# EAGLE design 05_08 (EAGLE 9.6.2)
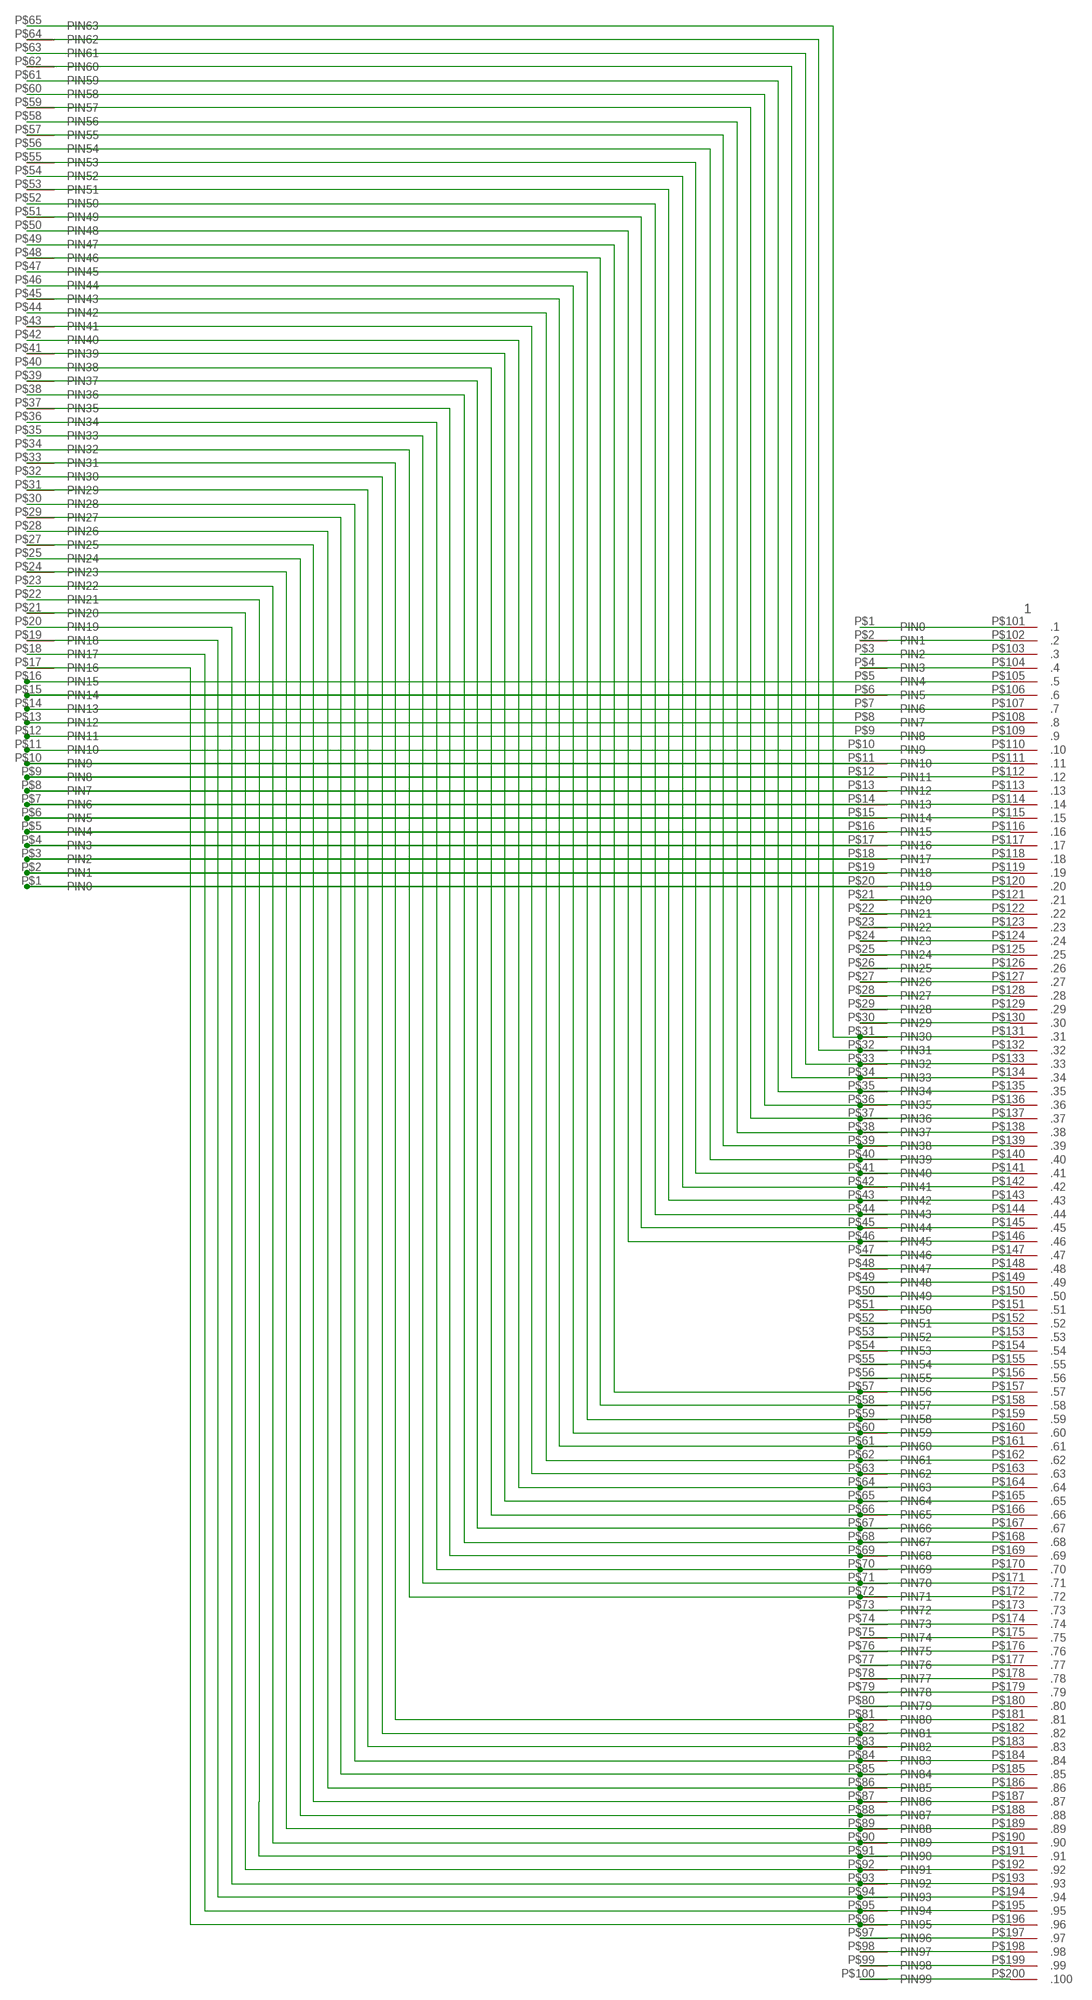
[diagram p0: schematic, sheet 1]

## Parts
U$1  TQFP_100_PIN_1  [TQFP_100PIN_PCB_1]
U$2  TQFP_100_PIN_2  [TQFP_100PIN_PCB_2]
U$3  TQFP_64_PIN  [TQFP_100PIN_PCB_08]

## Nets
1: U$1.P$1(PIN0) U$2.P$101(.1)
N$2: U$1.P$2(PIN1) U$2.P$102(.2)
N$3: U$1.P$3(PIN2) U$2.P$103(.3)
N$4: U$1.P$4(PIN3) U$2.P$104(.4)
N$5: U$1.P$7(PIN6) U$2.P$107(.7) U$3.P$14(PIN13)
N$6: U$1.P$6(PIN5) U$2.P$106(.6) U$3.P$15(PIN14)
N$7: U$1.P$8(PIN7) U$2.P$108(.8) U$3.P$13(PIN12)
N$8: U$1.P$9(PIN8) U$2.P$109(.9) U$3.P$12(PIN11)
N$9: U$1.P$10(PIN9) U$2.P$110(.10) U$3.P$11(PIN10)
N$10: U$1.P$30(PIN29) U$2.P$130(.30)
N$11: U$1.P$11(PIN10) U$2.P$111(.11) U$3.P$10(PIN9)
N$12: U$1.P$12(PIN11) U$2.P$112(.12) U$3.P$9(PIN8)
N$13: U$1.P$13(PIN12) U$2.P$113(.13) U$3.P$8(PIN7)
N$14: U$1.P$14(PIN13) U$2.P$114(.14) U$3.P$7(PIN6)
N$15: U$1.P$15(PIN14) U$2.P$115(.15) U$3.P$6(PIN5)
N$16: U$1.P$16(PIN15) U$2.P$116(.16) U$3.P$5(PIN4)
N$17: U$1.P$17(PIN16) U$2.P$117(.17) U$3.P$4(PIN3)
N$18: U$1.P$18(PIN17) U$2.P$118(.18) U$3.P$3(PIN2)
N$19: U$1.P$19(PIN18) U$2.P$119(.19) U$3.P$2(PIN1)
N$20: U$1.P$20(PIN19) U$2.P$120(.20) U$3.P$1(PIN0)
N$21: U$1.P$21(PIN20) U$2.P$121(.21)
N$22: U$1.P$22(PIN21) U$2.P$122(.22)
N$23: U$1.P$23(PIN22) U$2.P$123(.23)
N$24: U$1.P$24(PIN23) U$2.P$124(.24)
N$25: U$1.P$25(PIN24) U$2.P$125(.25)
N$26: U$1.P$26(PIN25) U$2.P$126(.26)
N$27: U$1.P$27(PIN26) U$2.P$127(.27)
N$28: U$1.P$28(PIN27) U$2.P$128(.28)
N$29: U$1.P$29(PIN28) U$2.P$129(.29)
N$32: U$1.P$32(PIN31) U$2.P$132(.32) U$3.P$64(PIN62)
N$33: U$1.P$33(PIN32) U$2.P$133(.33) U$3.P$63(PIN61)
N$34: U$1.P$34(PIN33) U$2.P$134(.34) U$3.P$62(PIN60)
N$35: U$1.P$35(PIN34) U$2.P$135(.35) U$3.P$61(PIN59)
N$36: U$1.P$36(PIN35) U$2.P$136(.36) U$3.P$60(PIN58)
N$37: U$1.P$37(PIN36) U$2.P$137(.37) U$3.P$59(PIN57)
N$38: U$1.P$38(PIN37) U$2.P$138(.38) U$3.P$58(PIN56)
N$39: U$1.P$39(PIN38) U$2.P$139(.39) U$3.P$57(PIN55)
N$40: U$1.P$40(PIN39) U$2.P$140(.40) U$3.P$56(PIN54)
N$41: U$1.P$41(PIN40) U$2.P$141(.41) U$3.P$55(PIN53)
N$42: U$1.P$42(PIN41) U$2.P$142(.42) U$3.P$54(PIN52)
N$43: U$1.P$43(PIN42) U$2.P$143(.43) U$3.P$53(PIN51)
N$44: U$1.P$44(PIN43) U$2.P$144(.44) U$3.P$52(PIN50)
N$45: U$1.P$45(PIN44) U$2.P$145(.45) U$3.P$51(PIN49)
N$46: U$1.P$46(PIN45) U$2.P$146(.46) U$3.P$50(PIN48)
N$47: U$1.P$47(PIN46) U$2.P$147(.47)
N$48: U$1.P$48(PIN47) U$2.P$148(.48)
N$49: U$1.P$49(PIN48) U$2.P$149(.49)
N$50: U$1.P$50(PIN49) U$2.P$150(.50)
N$51: U$1.P$51(PIN50) U$2.P$151(.51)
N$52: U$1.P$52(PIN51) U$2.P$152(.52)
N$53: U$1.P$53(PIN52) U$2.P$153(.53)
N$54: U$1.P$54(PIN53) U$2.P$154(.54)
N$55: U$1.P$55(PIN54) U$2.P$155(.55)
N$56: U$1.P$56(PIN55) U$2.P$156(.56)
N$57: U$1.P$57(PIN56) U$2.P$157(.57) U$3.P$49(PIN47)
N$58: U$1.P$58(PIN57) U$2.P$158(.58) U$3.P$48(PIN46)
N$59: U$1.P$59(PIN58) U$2.P$159(.59) U$3.P$47(PIN45)
N$60: U$1.P$60(PIN59) U$2.P$160(.60) U$3.P$46(PIN44)
N$61: U$1.P$61(PIN60) U$2.P$161(.61) U$3.P$45(PIN43)
N$62: U$1.P$62(PIN61) U$2.P$162(.62) U$3.P$44(PIN42)
N$63: U$1.P$63(PIN62) U$2.P$163(.63) U$3.P$43(PIN41)
N$64: U$1.P$64(PIN63) U$2.P$164(.64) U$3.P$42(PIN40)
N$65: U$1.P$65(PIN64) U$2.P$165(.65) U$3.P$41(PIN39)
N$66: U$1.P$66(PIN65) U$2.P$166(.66) U$3.P$40(PIN38)
N$67: U$1.P$67(PIN66) U$2.P$167(.67) U$3.P$39(PIN37)
N$68: U$1.P$68(PIN67) U$2.P$168(.68) U$3.P$38(PIN36)
N$69: U$1.P$69(PIN68) U$2.P$169(.69) U$3.P$37(PIN35)
N$70: U$1.P$70(PIN69) U$2.P$170(.70) U$3.P$36(PIN34)
N$71: U$1.P$71(PIN70) U$2.P$171(.71) U$3.P$35(PIN33)
N$72: U$1.P$72(PIN71) U$2.P$172(.72) U$3.P$34(PIN32)
N$73: U$1.P$73(PIN72) U$2.P$173(.73)
N$74: U$1.P$74(PIN73) U$2.P$174(.74)
N$75: U$1.P$75(PIN74) U$2.P$175(.75)
N$76: U$1.P$76(PIN75) U$2.P$176(.76)
N$77: U$1.P$77(PIN76) U$2.P$177(.77)
N$78: U$1.P$78(PIN77) U$2.P$178(.78)
N$79: U$1.P$79(PIN78) U$2.P$179(.79)
N$80: U$1.P$80(PIN79) U$2.P$180(.80)
N$81: U$1.P$81(PIN80) U$2.P$181(.81) U$3.P$33(PIN31)
N$82: U$1.P$82(PIN81) U$2.P$182(.82) U$3.P$32(PIN30)
N$83: U$1.P$83(PIN82) U$2.P$183(.83) U$3.P$31(PIN29)
N$84: U$1.P$84(PIN83) U$2.P$184(.84) U$3.P$30(PIN28)
N$85: U$1.P$85(PIN84) U$2.P$185(.85) U$3.P$29(PIN27)
N$86: U$1.P$86(PIN85) U$2.P$186(.86) U$3.P$28(PIN26)
N$87: U$1.P$87(PIN86) U$2.P$187(.87) U$3.P$27(PIN25)
N$88: U$1.P$88(PIN87) U$2.P$188(.88) U$3.P$25(PIN24)
N$89: U$1.P$89(PIN88) U$2.P$189(.89) U$3.P$24(PIN23)
N$90: U$1.P$90(PIN89) U$2.P$190(.90) U$3.P$23(PIN22)
N$91: U$1.P$91(PIN90) U$2.P$191(.91) U$3.P$22(PIN21)
N$92: U$1.P$92(PIN91) U$2.P$192(.92) U$3.P$21(PIN20)
N$93: U$1.P$93(PIN92) U$2.P$193(.93) U$3.P$20(PIN19)
N$94: U$1.P$94(PIN93) U$2.P$194(.94) U$3.P$19(PIN18)
N$95: U$1.P$95(PIN94) U$2.P$195(.95) U$3.P$18(PIN17)
N$96: U$1.P$96(PIN95) U$2.P$196(.96) U$3.P$17(PIN16)
N$97: U$1.P$97(PIN96) U$2.P$197(.97)
N$98: U$1.P$98(PIN97) U$2.P$198(.98)
N$99: U$1.P$99(PIN98) U$2.P$199(.99)
N$100: U$1.P$100(PIN99) U$2.P$200(.100)
N$101: U$1.P$31(PIN30) U$2.P$131(.31) U$3.P$65(PIN63)
N$102: U$1.P$5(PIN4) U$2.P$105(.5) U$3.P$16(PIN15)

## Library data of the parts
U$1 = MyUserLib:TQFP_100_PIN_1
U$2 = MyUserLib:TQFP_100_PIN_2
U$3 = MyUserLib:TQFP_64_PIN

## Board
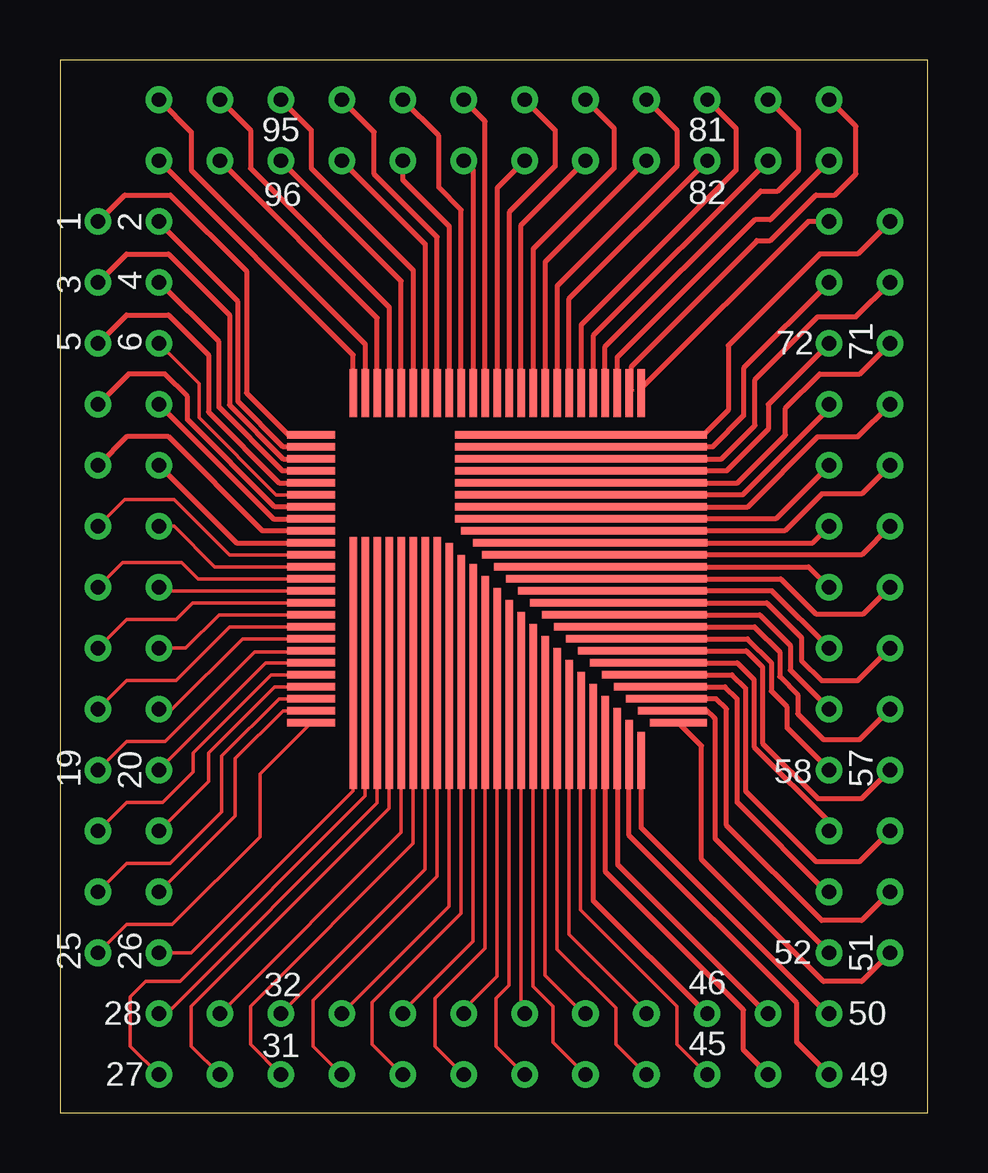
[diagram p1: board, top side]
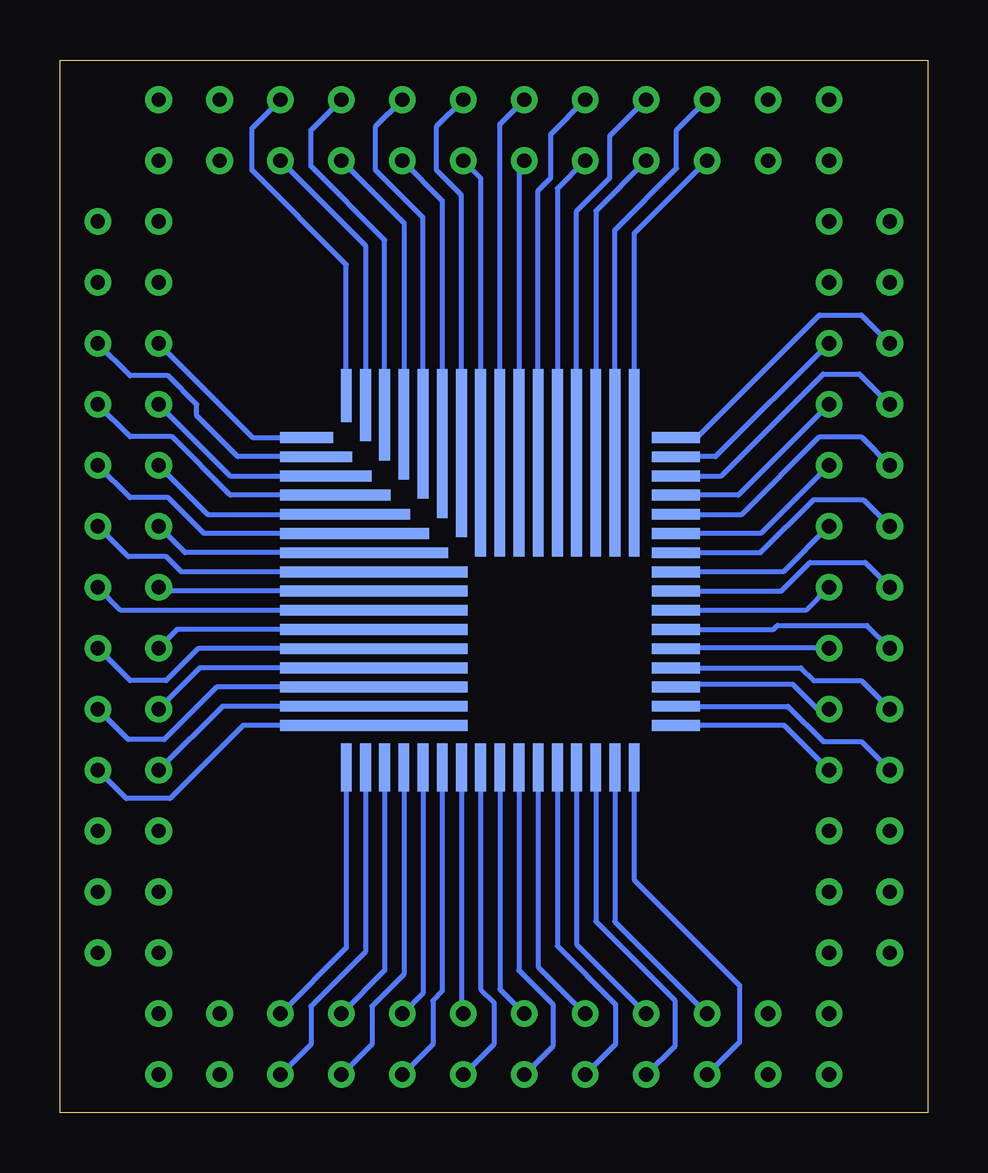
[diagram p2: board, bottom side, seen from below]

Size 36.18 x 43.88 mm. Coordinates in mm from the lower left corner, seen from the top.
Outline: 0,0 36.18,0 36.18,43.88 0,43.88 0,0
Copper layers (1*16): Top 0.035mm / dielectric 1.5mm / Bottom 0.035mm
Design rules "default *": minimum track width 6mil, minimum drill 0.35mm, track to track 6mil, track to pad 6mil, pad to pad 6mil, via to via 6mil, smd to smd 6mil, copper to edge 40mil, drill to drill 6mil, minimum pad ring 10mil, minimum via ring 8mil, stop-mask expansion 4mil, vias tented up to drill 0mil, thermal gap 10mil

### Footprints (pad centres in the part's own frame; a part is rotated, then mirrored left to right if it is on the bottom)
TQFP_100PIN_PCB_1 = smd 2 x 0.3: P$1 1.27,2.54; P$2 1.27,2.04; P$3 1.27,1.54; P$4 1.27,1.04; P$5 1.27,0.54; P$6 1.27,0.04; P$7 1.27,-0.46; P$8 1.27,-0.96; P$9 1.27,-1.46; P$10 1.27,-1.96; P$11 1.27,-2.46; P$12 1.27,-2.96; P$13 1.27,-3.46; P$14 1.27,-3.96; P$15 1.27,-4.46; P$16 1.27,-4.96; P$17 1.27,-5.46; P$18 1.27,-5.96; P$19 1.27,-6.46; P$20 1.27,-6.96; P$21 1.27,-7.46; P$22 1.27,-7.96; P$23 1.27,-8.46; P$24 1.27,-8.96; P$25 1.27,-9.46 | smd 0.3 x 10.5: P$26 3.02,-6.96; P$27 3.52,-6.96; P$28 4.02,-6.96; P$29 4.52,-6.96; P$30 5.02,-6.96; P$31 5.52,-6.96; P$32 6.02,-6.96; P$33 6.52,-6.96 | smd 0.3 x 10.25: P$34 7.02,-7.085 | smd 0.3 x 9.75: P$35 7.52,-7.335 | smd 0.3 x 9.375: P$36 8.02,-7.522 | smd 0.3 x 8.875: P$37 8.52,-7.772 | smd 0.3 x 8.375: P$38 9.02,-8.023 | smd 0.3 x 7.875: P$39 9.52,-8.273 | smd 0.3 x 7.375: P$40 10.02,-8.523 | smd 0.3 x 6.875: P$41 10.52,-8.773 | smd 0.3 x 6.375: P$42 11.02,-9.023 | smd 0.3 x 5.875: P$43 11.52,-9.273 | smd 0.3 x 5.375: P$44 12.02,-9.523 | smd 0.3 x 4.875: P$45 12.52,-9.773 | smd 0.3 x 4.375: P$46 13.02,-10.023 | smd 0.3 x 3.875: P$47 13.52,-10.273 | smd 0.3 x 3.375: P$48 14.02,-10.523 | smd 0.3 x 2.875: P$49 14.52,-10.773 | smd 0.3 x 2.375: P$50 15.02,-11.023 | smd 2.375 x 0.3: P$51 16.582,-9.46 | smd 2.875 x 0.3: P$52 16.332,-8.96 | smd 3.375 x 0.3: P$53 16.082,-8.46 | smd 3.875 x 0.3: P$54 15.832,-7.96 | smd 4.375 x 0.3: P$55 15.582,-7.46 | smd 4.875 x 0.3: P$56 15.332,-6.96 | smd 5.375 x 0.3: P$57 15.082,-6.46 | smd 5.875 x 0.3: P$58 14.832,-5.96 | smd 6.375 x 0.3: P$59 14.582,-5.46 | smd 6.875 x 0.3: P$60 14.332,-4.96 | smd 7.375 x 0.3: P$61 14.082,-4.46 | smd 7.875 x 0.3: P$62 13.832,-3.96 | smd 8.375 x 0.3: P$63 13.582,-3.46 | smd 8.875 x 0.3: P$64 13.332,-2.96 | smd 9.375 x 0.3: P$65 13.082,-2.46 | smd 9.78 x 0.3: P$66 12.895,-1.96 | smd 10.25 x 0.3: P$67 12.645,-1.46 | smd 10.5 x 0.3: P$68 12.52,-0.96; P$69 12.52,-0.46; P$70 12.52,0.04; P$71 12.52,0.54; P$72 12.52,1.04; P$73 12.52,1.54; P$74 12.52,2.04; P$75 12.52,2.54 | smd 0.3 x 2: P$76 15.02,4.29; P$77 14.52,4.29; P$78 14.02,4.29; P$79 13.52,4.29; P$80 13.02,4.29; P$81 12.52,4.29; P$82 12.02,4.29; P$83 11.52,4.29; P$84 11.02,4.29; P$85 10.52,4.29; P$86 10.02,4.29; P$87 9.52,4.29; P$88 9.02,4.29; P$89 8.52,4.29; P$90 8.02,4.29; P$91 7.52,4.29; P$92 7.02,4.29; P$93 6.52,4.29; P$94 6.02,4.29; P$95 5.52,4.29; P$96 5.02,4.29; P$97 4.52,4.29; P$98 4.02,4.29; P$99 3.52,4.29; P$100 3.02,4.29
TQFP_100PIN_PCB_2 = drill 0.6: P$101 -7.62,12.7; P$102 -5.08,12.7; P$103 -7.62,10.16; P$104 -5.08,10.16; P$105 -7.62,7.62; P$106 -5.08,7.62; P$107 -7.62,5.08; P$108 -5.08,5.08; P$109 -7.62,2.54; P$110 -5.08,2.54; P$111 -7.62,0; P$112 -5.08,0; P$113 -7.62,-2.54; P$114 -5.08,-2.54; P$115 -7.62,-5.08; P$116 -5.08,-5.08; P$117 -7.62,-7.62; P$118 -5.08,-7.62; P$119 -7.62,-10.16; P$120 -5.08,-10.16; P$121 -7.62,-12.7; P$122 -5.08,-12.7; P$123 -7.62,-15.24; P$124 -5.08,-15.24; P$125 -7.62,-17.78; P$126 -5.08,-17.78; P$127 -5.08,-22.86; P$128 -5.08,-20.32; P$129 -2.54,-22.86; P$130 -2.54,-20.32; P$131 0,-22.86; P$132 0,-20.32; P$133 2.54,-22.86; P$134 2.54,-20.32; P$135 5.08,-22.86; P$136 5.08,-20.32; P$137 7.62,-22.86; P$138 7.62,-20.32; P$139 10.16,-22.86; P$140 10.16,-20.32; P$141 12.7,-22.86; P$142 12.7,-20.32; P$143 15.24,-22.86; P$144 15.24,-20.32; P$145 17.78,-22.86; P$146 17.78,-20.32; P$147 20.32,-22.86; P$148 20.32,-20.32; P$149 22.86,-22.86; P$150 22.86,-20.32; P$151 25.4,-17.78; P$152 22.86,-17.78; P$153 25.4,-15.24; P$154 22.86,-15.24; P$155 25.4,-12.7; P$156 22.86,-12.7; P$157 25.4,-10.16; P$158 22.86,-10.16; P$159 25.4,-7.62; P$160 22.86,-7.62; P$161 25.4,-5.08; P$162 22.86,-5.08; P$163 25.4,-2.54; P$164 22.86,-2.54; P$165 25.4,0; P$166 22.86,0; P$167 25.4,2.54; P$168 22.86,2.54; P$169 25.4,5.08; P$170 22.86,5.08; P$171 25.4,7.62; P$172 22.86,7.62; P$173 25.4,10.16; P$174 22.86,10.16; P$175 25.4,12.7; P$176 22.86,12.7; P$177 22.86,17.78; P$178 22.86,15.24; P$179 20.32,17.78; P$180 20.32,15.24; P$181 17.78,17.78; P$182 17.78,15.24; P$183 15.24,17.78; P$184 15.24,15.24; P$185 12.7,17.78; P$186 12.7,15.24; P$187 10.16,17.78; P$188 10.16,15.24; P$189 7.62,17.78; P$190 7.62,15.24; P$191 5.08,17.78; P$192 5.08,15.24; P$193 2.54,17.78; P$194 2.54,15.24; P$195 0,17.78; P$196 0,15.24; P$197 -2.54,17.78; P$198 -2.54,15.24; P$199 -5.08,17.78; P$200 -5.08,15.24
TQFP_100PIN_PCB_08 = smd 2 x 0.45: P$1 -7.6,6; P$2 -7.6,5.2; P$3 -7.6,4.4; P$4 -7.6,3.6; P$5 -7.6,2.8; P$6 -7.6,2; P$7 -7.6,1.2; P$8 -7.6,0.4; P$9 -7.6,-0.4; P$10 -7.6,-1.2; P$11 -7.6,-2; P$12 -7.6,-2.8; P$13 -7.6,-3.6; P$14 -7.6,-4.4; P$15 -7.6,-5.2; P$16 -7.6,-6 | smd 0.45 x 7.8: P$17 -5.85,-4.95; P$18 -5.05,-4.95; P$19 -4.25,-4.95; P$20 -3.45,-4.95; P$21 -2.65,-4.95; P$22 -1.85,-4.95; P$23 -1.05,-4.95; P$24 -0.25,-4.95; P$25 0.55,-4.95 | smd 0.45 x 7: P$27 1.35,-5.35 | smd 0.45 x 6.2: P$28 2.15,-5.75 | smd 0.45 x 5.4: P$29 2.95,-6.15 | smd 0.45 x 4.6: P$30 3.75,-6.55 | smd 0.45 x 3.8: P$31 4.55,-6.95 | smd 0.45 x 3: P$32 5.35,-7.35 | smd 0.45 x 2.2: P$33 6.15,-7.75 | smd 2.2 x 0.45: P$34 7.8,-6 | smd 3 x 0.45: P$35 7.4,-5.2 | smd 3.8 x 0.45: P$36 7,-4.4 | smd 4.6 x 0.45: P$37 6.6,-3.6 | smd 5.4 x 0.45: P$38 6.2,-2.8 | smd 6.2 x 0.45: P$39 5.8,-2 | smd 7 x 0.45: P$40 5.4,-1.2 | smd 7.8 x 0.45: P$41 5,-0.4; P$42 5,0.4; P$43 5,1.2; P$44 5,2; P$45 5,2.8; P$46 5,3.6; P$47 5,4.4; P$48 5,5.2; P$49 5,6 | smd 0.45 x 2: P$50 6.15,7.75; P$51 5.35,7.75; P$52 4.55,7.75; P$53 3.75,7.75; P$54 2.95,7.75; P$55 2.15,7.75; P$56 1.35,7.75; P$57 0.55,7.75; P$58 -0.25,7.75; P$59 -1.05,7.75; P$60 -1.85,7.75; P$61 -2.65,7.75; P$62 -3.45,7.75; P$63 -4.25,7.75; P$64 -5.05,7.75; P$65 -5.85,7.75

### Placement (x,y rotation side)
U$1  9.21,25.72 0 top
U$2  9.21,24.45 0 top
U$3  18.1,22.15 180 bottom

### Tracks (layer width: path | path; a pad name or v marks a point on that pad's centre or on a via)
1
  Top 0.203: U$2.P$101 2.7,38.26 4.6,38.26 7.78,35.08 7.78,30 9.53,28.26 U$1.P$1
N$2
  Top 0.203: U$1.P$2 9.31,27.76 7.42,29.65 7.42,33.8 4.13,37.09 U$2.P$102
N$3
  Top 0.203: U$2.P$103 2.78,35.8 4.52,35.8 7.06,33.26 7.06,29.5 9.31,27.26 U$1.P$3
N$4
  Top 0.203: U$1.P$4 9.28,26.76 6.63,29.41 6.63,32.13 4.15,34.61 U$2.P$104
N$5
  Top 0.203: U$1.P$7 8.95,25.26 5.32,28.89 5.32,29.84 4.37,30.8 2.86,30.8 U$2.P$107
  Bottom 0.203: U$3.P$14 8.62,26.55 4.37,30.8 2.86,30.8 U$2.P$107
N$6
  Top 0.152: U$2.P$106 5.79,30.4 5.79,28.97 9.01,25.76 U$1.P$6
  Bottom 0.203: U$2.P$106 8.85,27.35 U$3.P$15
N$7
  Top 0.203: U$2.P$108 8.9,24.76 U$1.P$8
  Bottom 0.203: U$2.P$108 7.91,25.75 U$3.P$13
N$8
  Top 0.203: U$1.P$9 8.45,24.26 4.52,28.18 2.78,28.18 U$2.P$109
  Bottom 0.203: U$3.P$12 7.76,24.95 4.52,28.18 2.78,28.18 U$2.P$109
N$9
  Top 0.203: U$2.P$110 7.36,23.76 U$1.P$10
  Bottom 0.203: U$2.P$110 6.97,24.15 U$3.P$11
N$10
  Top 0.152: U$2.P$130 14.23,11.69 U$1.P$30
N$11
  Top 0.152: U$1.P$11 7.06,23.26 4.76,25.56 2.7,25.56 U$2.P$111
  Bottom 0.203: U$3.P$10 6.98,23.35 4.76,25.56 2.7,25.56 U$2.P$111
N$12
  Top 0.152: U$2.P$112 4.76,24.45 6.45,22.76 U$1.P$12
  Bottom 0.203: U$2.P$112 6.03,22.55 U$3.P$9
N$13
  Top 0.152: U$1.P$13 5.76,22.26 5.08,22.94 2.62,22.94 U$2.P$113
  Bottom 0.203: U$3.P$8 6.12,21.75 4.92,22.94 2.62,22.94 U$2.P$113
N$14
  Top 0.152: U$2.P$114 4.28,21.76 U$1.P$14
  Bottom 0.203: U$2.P$114 5.09,20.95 U$3.P$7
N$15
  Top 0.152: U$1.P$15 5.54,21.26 4.84,20.56 2.78,20.56 U$2.P$115
  Bottom 0.203: U$3.P$6 6.45,20.15 6.27,20.32 2.54,20.32 U$2.P$115
N$16
  Top 0.152: U$2.P$116 5.24,19.37 6.63,20.76 U$1.P$16
  Bottom 0.203: U$2.P$116 10.48,19.37 U$3.P$5
N$17
  Top 0.152: U$1.P$17 7.08,20.26 4.84,18.02 2.78,18.02 U$2.P$117
  Bottom 0.203: U$3.P$4 5.29,18.55 4.76,18.02 2.78,18.02 U$2.P$117
N$18
  Top 0.152: U$2.P$118 4.68,16.83 7.61,19.76 U$1.P$18
  Bottom 0.203: U$2.P$118 4.6,16.83 5.64,17.86 10.38,17.86 U$3.P$3
N$19
  Top 0.152: U$2.P$119 2.78,15.48 4.38,15.48 8.11,19.21 10.44,19.21 U$1.P$19
  Bottom 0.203: U$3.P$2 5.83,16.95 4.37,15.48 2.78,15.48 U$2.P$119
N$20
  Top 0.152: U$1.P$20 8.56,18.76 4.13,14.32 U$2.P$120
  Bottom 0.203: U$2.P$120 5.99,16.15 U$3.P$1
N$21
  Top 0.152: U$2.P$121 2.78,12.94 4.29,12.94 5.56,14.21 5.56,15 8.81,18.26 U$1.P$21
N$22
  Top 0.152: U$1.P$22 8.95,17.76 6.19,15 6.19,13.81 U$2.P$122
N$23
  Top 0.152: U$2.P$123 2.78,10.4 4.6,10.4 6.75,12.54 6.75,14.88 9.13,17.26 U$1.P$23
N$24
  Top 0.152: U$2.P$124 7.3,12.38 7.3,14.76 9.3,16.76 U$1.P$24
N$25
  Top 0.152: U$2.P$125 2.78,7.86 4.68,7.86 8.33,11.51 8.33,14.11 U$1.P$25
N$26
  Top 0.152: U$1.P$26 12.23,13.42 5.48,6.67 U$2.P$126
N$27
  Top 0.152: U$2.P$127 2.94,2.78 2.94,4.84 3.57,5.48 5,5.48 12.73,13.2 U$1.P$27
N$28
  Top 0.152: U$2.P$128 4.45,4.13 13.23,12.91 U$1.P$28
N$29
  Top 0.152: U$1.P$29 13.73,12.7 5.48,4.45 5.48,2.78 U$2.P$129
N$32
  Top 0.152: U$2.P$132 15.23,10.15 U$1.P$32
  Bottom 0.203: U$3.P$64 13.05,7.97 U$2.P$132
N$33
  Top 0.152: U$1.P$33 15.73,9.85 10.56,4.68 10.56,2.78 U$2.P$133
  Bottom 0.203: U$3.P$63 13.85,7.97 10.56,4.68 10.56,2.78 U$2.P$133
N$34
  Top 0.152: U$2.P$134 16.23,8.61 U$1.P$34
  Bottom 0.203: U$3.P$62 14.65,7.03 U$2.P$134
N$35
  Top 0.152: U$1.P$35 16.73,8.31 13.02,4.6 13.02,2.86 U$2.P$135
  Bottom 0.203: U$3.P$61 15.45,6.95 13.02,4.52 13.02,2.86 U$2.P$135
N$36
  Top 0.152: U$2.P$136 14.29,4.21 17.23,7.15 U$1.P$36
  Bottom 0.203: U$3.P$60 16.25,6.09 U$2.P$136
N$37
  Top 0.152: U$1.P$37 17.73,6.85 15.64,4.76 15.64,2.78 U$2.P$137
  Bottom 0.203: U$3.P$59 17.05,5.93 15.64,4.52 15.64,2.78 U$2.P$137
N$38
  Top 0.152: U$1.P$38 18.23,5.69 16.83,4.29 U$2.P$138
  Bottom 0.203: U$3.P$58 17.85,5.15 U$2.P$138
N$39
  Top 0.152: U$1.P$39 18.73,5.31 18.18,4.76 18.18,2.78 U$2.P$139
  Bottom 0.203: U$3.P$57 18.65,5.15 18.1,4.6 18.1,2.86 U$2.P$139
N$40
  Top 0.152: U$2.P$140 19.23,4.27 U$1.P$40
  Bottom 0.203: U$3.P$56 19.45,4.21 U$2.P$140
N$41
  Top 0.152: U$1.P$41 19.73,5.28 20.56,4.45 20.56,2.94 U$2.P$141
  Bottom 0.203: U$3.P$55 20.25,5.07 20.64,4.68 20.64,2.86 U$2.P$141
N$42
  Top 0.152: U$1.P$42 20.23,5.73 21.83,4.13 U$2.P$142
  Bottom 0.203: U$3.P$54 21.05,4.99 U$2.P$142
N$43
  Top 0.152: U$1.P$43 20.73,6.82 23.18,4.37 23.18,2.86 U$2.P$143
  Bottom 0.203: U$3.P$53 21.85,5.78 23.18,4.45 23.18,2.86 U$2.P$143
N$44
  Top 0.152: U$2.P$144 24.45,4.21 21.23,7.43 U$1.P$44
  Bottom 0.203: U$3.P$52 22.65,5.93 U$2.P$144
N$45
  Top 0.152: U$1.P$45 21.69,15.91 21.69,8.45 25.72,4.43 25.72,2.86 U$2.P$145
  Bottom 0.203: U$3.P$51 23.45,6.71 25.72,4.45 25.72,2.86 U$2.P$145
N$46
  Top 0.203: U$1.P$46 22.23,8.86 26.96,4.13 U$2.P$146
  Bottom 0.203: U$3.P$50 24.25,6.87 U$2.P$146
N$47
  Top 0.203: U$2.P$147 28.5,2.62 28.5,4.29 22.74,10.04 22.74,15.43 U$1.P$47
N$48
  Top 0.203: U$1.P$48 23.24,15.18 23.24,10.36 29.47,4.13 U$2.P$148
N$49
  Top 0.203: U$2.P$149 30.72,2.94 30.72,4.58 23.73,11.57 U$1.P$49
N$50
  Top 0.203: U$1.P$50 24.23,11.89 31.99,4.13 U$2.P$150
N$51
  Top 0.203: U$2.P$151 33.42,5.48 31.83,5.48 26.75,10.56 26.75,15.3 U$1.P$51
N$52
  Top 0.203: U$1.P$52 26.99,16.76 27.23,16.51 27.23,16.5 27.3,16.43 27.3,11.43 U$2.P$152
N$53
  Top 0.203: U$2.P$153 33.42,8.02 31.75,8.02 27.78,11.99 27.78,16.83 27.35,17.26 U$1.P$53
N$54
  Top 0.203: U$1.P$54 27.72,17.76 28.22,17.26 28.22,12.95 32.04,9.13 32.04,9.18 U$2.P$154
N$55
  Top 0.203: U$1.P$55 28.02,18.26 28.57,17.7 28.57,13.41 31.51,10.48 33.34,10.48 U$2.P$155
N$56
  Top 0.203: U$1.P$56 28.23,18.76 28.93,18.05 28.93,15.25 32.07,12.12 U$2.P$156
N$57
  Top 0.203: U$2.P$157 33.42,13.1 31.59,13.1 29.29,15.4 29.29,18.57 28.61,19.26 U$1.P$57
  Bottom 0.203: U$3.P$49 28.54,16.15 31.59,13.1 33.42,13.1 U$2.P$157
N$58
  Top 0.203: U$2.P$158 30.32,16.03 30.32,16.91 29.65,17.58 29.65,18.77 28.66,19.76 U$1.P$58
  Bottom 0.203: U$3.P$48 29.41,16.95 U$2.P$158
N$59
  Top 0.203: U$2.P$159 33.34,15.56 31.83,15.56 30.76,16.63 30.76,17.42 30,18.18 30,19.21 28.95,20.26 U$1.P$59
  Bottom 0.203: U$3.P$47 29.64,17.75 31.83,15.56 33.34,15.56 U$2.P$159
N$60
  Top 0.203: U$2.P$160 30.44,18.45 30.44,19.49 29.17,20.76 U$1.P$60
  Bottom 0.203: U$3.P$46 30.35,18.55 U$2.P$160
N$61
  Top 0.203: U$2.P$161 33.26,18.02 31.75,18.02 30.92,18.85 30.92,19.8 29.46,21.26 U$1.P$61
  Bottom 0.203: U$3.P$45 30.42,19.35 31.75,18.02 33.26,18.02 U$2.P$161
N$62
  Top 0.203: U$2.P$162 29.68,21.76 U$1.P$62
  Bottom 0.203: U$3.P$44 31.29,20.15 U$2.P$162
N$63
  Top 0.203: U$1.P$63 30.05,22.26 31.51,20.8 33.5,20.8 U$2.P$163
  Bottom 0.203: U$3.P$43 33.65,20.95 U$2.P$163
N$64
  Top 0.203: U$1.P$64 31.22,22.76 U$2.P$164
  Bottom 0.203: U$3.P$42 31.91,21.75 U$2.P$164
N$65
  Top 0.203: U$2.P$165 33.42,23.26 U$1.P$65
  Bottom 0.203: U$3.P$41 31.12,22.55 31.75,23.18 33.34,23.18 U$2.P$165
N$66
  Top 0.203: U$1.P$66 31.38,23.76 U$2.P$166
  Bottom 0.203: U$3.P$40 30.97,23.35 U$2.P$166
N$67
  Top 0.203: U$2.P$167 33.42,25.8 31.75,25.8 30.21,24.26 U$1.P$67
  Bottom 0.203: U$3.P$39 30.18,24.15 31.67,25.64 33.26,25.64 U$2.P$167
N$68
  Top 0.203: U$2.P$168 29.84,24.76 U$1.P$68
  Bottom 0.203: U$2.P$168 30.03,24.95 U$3.P$38
N$69
  Top 0.203: U$1.P$69 28.67,25.26 31.59,28.18 33.26,28.18 U$2.P$169
  Bottom 0.203: U$3.P$37 29.08,25.75 31.51,28.18 33.26,28.18 U$2.P$169
N$70
  Top 0.203: U$2.P$170 32.07,29.37 28.46,25.76 U$1.P$70
  Bottom 0.203: U$2.P$170 29.09,26.55 U$3.P$36
N$71
  Top 0.203: U$1.P$71 28.24,26.26 30.24,28.26 30.24,29.37 31.67,30.8 33.34,30.8 U$2.P$171
  Bottom 0.203: U$3.P$35 28.77,27.35 30.48,29.05 30.48,29.53 31.67,30.72 33.26,30.72 U$2.P$171
N$72
  Top 0.203: U$2.P$172 29.53,29.53 29.53,28.5 27.78,26.75 21.74,26.75 U$1.P$72
  Bottom 0.203: U$2.P$172 28.15,28.15 U$3.P$34
N$73
  Top 0.203: U$1.P$73 27.57,27.26 28.97,28.65 28.97,30.56 31.59,33.18 33.18,33.18 U$2.P$173
N$74
  Top 0.203: U$2.P$174 28.5,31.04 28.5,29.05 27.2,27.76 U$1.P$74
N$75
  Top 0.203: U$2.P$175 33.26,35.8 31.67,35.8 27.86,31.99 27.86,29.29 26.83,28.26 U$1.P$75
N$76
  Top 0.203: U$1.P$76 24.23,30.18 31.19,37.15 U$2.P$176
N$77
  Top 0.203: U$1.P$77 23.82,30.1 23.82,31.11 29.05,36.34 29.05,36.35 29.61,36.35 31.51,38.26 32.31,38.26 33.18,39.13 33.18,41.12 U$2.P$177
N$78
  Top 0.203: U$2.P$178 29.61,37.23 28.97,37.23 23.23,31.48 U$1.P$78
N$79
  Top 0.203: U$1.P$79 22.73,31.93 29.21,38.42 29.92,38.42 30.8,39.29 30.8,40.96 U$2.P$179
N$80
  Top 0.203: U$2.P$180 22.23,32.39 U$1.P$80
N$81
  Top 0.203: U$2.P$181 28.18,41.04 28.18,39.29 21.73,32.84 U$1.P$81
  Bottom 0.203: U$3.P$33 24.25,35.36 28.18,39.29 28.18,41.04 U$2.P$181
N$82
  Top 0.203: U$1.P$82 21.23,33.93 U$2.P$182
  Bottom 0.203: U$2.P$182 23.45,36.15 U$3.P$32
N$83
  Top 0.203: U$2.P$183 25.72,40.96 25.72,39.45 20.73,34.46 U$1.P$83
  Bottom 0.203: U$3.P$31 22.65,36.38 25.72,39.45 25.72,40.96 U$2.P$183
N$84
  Top 0.203: U$2.P$184 20.23,35.47 U$1.P$84
  Bottom 0.203: U$2.P$184 21.85,37.09 U$3.P$30
N$85
  Top 0.203: U$2.P$185 23.1,41.04 23.1,39.37 19.73,36 U$1.P$85
  Bottom 0.203: U$3.P$29 21.05,37.32 23.02,39.29 23.02,41.12 U$2.P$185
N$86
  Top 0.203: U$1.P$86 19.23,37.01 U$2.P$186
  Bottom 0.203: U$2.P$186 20.25,38.03 U$3.P$28
N$87
  Top 0.203: U$2.P$187 20.64,40.96 20.64,39.45 18.73,37.54 U$1.P$87
  Bottom 0.203: U$3.P$27 19.45,38.26 20.48,39.29 20.48,41.12 U$2.P$187
N$88
  Top 0.203: U$2.P$188 18.23,38.55 U$1.P$88
  Bottom 0.203: U$2.P$188 18.65,38.97 U$3.P$25
N$89
  Top 0.203: U$1.P$89 17.73,41.33 U$2.P$189
  Bottom 0.203: U$3.P$24 17.85,41.21 U$2.P$189
N$90
  Top 0.203: U$2.P$190 17.23,39.29 U$1.P$90
  Bottom 0.203: U$2.P$190 17.05,39.47 U$3.P$23
N$91
  Top 0.203: U$1.P$91 16.73,37.64 15.8,38.58 15.8,40.72 U$2.P$191
  Bottom 0.203: U$3.P$22 16.25,38.44 15.72,38.97 15.72,40.8 U$2.P$191
N$92
  Top 0.203: U$2.P$192 14.29,38.89 16.23,36.95 U$1.P$92
  Bottom 0.203: U$2.P$192 15.45,38.53 U$3.P$21
N$93
  Top 0.203: U$1.P$93 15.73,36.5 13.1,39.13 13.1,40.88 U$2.P$193
  Bottom 0.203: U$3.P$20 14.65,37.58 13.26,38.97 13.26,40.72 U$2.P$193
N$94
  Top 0.203: U$2.P$194 15.23,36.21 U$1.P$94
  Bottom 0.203: U$2.P$194 13.85,37.59 U$3.P$19
N$95
  Top 0.203: U$2.P$195 10.48,40.96 10.48,39.37 14.73,35.12 U$1.P$95
  Bottom 0.203: U$3.P$18 13.05,36.8 10.48,39.37 10.48,40.96 U$2.P$195
N$96
  Top 0.203: U$1.P$96 14.23,34.67 U$2.P$196
  Bottom 0.203: U$2.P$196 12.25,36.65 U$3.P$17
N$97
  Top 0.203: U$2.P$197 7.94,40.96 7.94,39.37 13.73,33.58 U$1.P$97
N$98
  Top 0.203: U$1.P$98 13.23,33.13 U$2.P$198
N$99
  Top 0.203: U$2.P$199 5.48,40.88 5.48,39.29 12.73,32.04 U$1.P$99
N$100
  Top 0.203: U$1.P$100 12.23,31.59 U$2.P$200
N$101
  Top 0.152: U$1.P$31 14.73,11.23 7.94,4.45 7.94,2.86 U$2.P$131
  Bottom 0.203: U$3.P$65 12.25,9.71 7.86,5.32 7.86,2.94 U$2.P$131
N$102
  Top 0.203: U$2.P$105 2.78,33.26 4.52,33.26 6.19,31.59 6.19,29.21 9.14,26.26 U$1.P$5
  Bottom 0.203: U$3.P$16 9.64,28.15 4.52,33.26 2.78,33.26 U$2.P$105

### Text on the board
tPlace: 1 | 2 | 3 | 4 | 5 | 6 | 19 | 20 | 25 | 26 | 28 | 27
tNames: 95 | 81 | 96 | 82 | 72 | 71 | 58 | 57 | 52 | 51 | 32 | 46 | 50 | 31 | 45 | 49